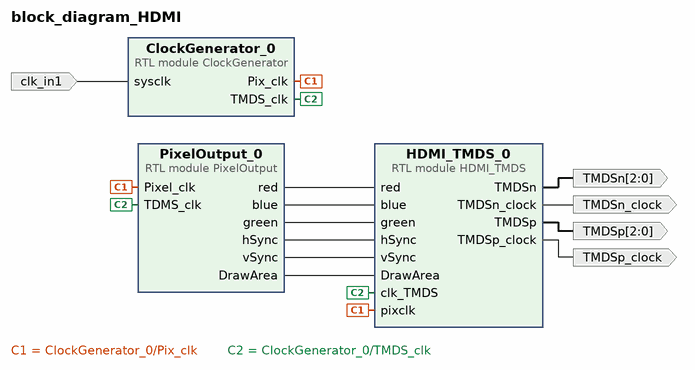
[diagram p0: block diagram of the top level]
# Vivado block design block_diagram_HDMI, xc7z020clg400-1, Vivado 2018.2
create_bd_design block_diagram_HDMI

create_bd_port -dir O -type clk TMDSn_clock
create_bd_port -dir O -type clk TMDSp_clock
create_bd_port -dir O -from 2 -to 0 TMDSp
create_bd_port -dir O -from 2 -to 0 TMDSn
create_bd_port -dir I clk_in1

create_bd_cell -type module -reference HDMI_TMDS HDMI_TMDS_0
create_bd_cell -type module -reference ClockGenerator ClockGenerator_0
create_bd_cell -type module -reference PixelOutput PixelOutput_0

# ---- connections ----

connect_bd_net [get_bd_pins PixelOutput_0/red] [get_bd_pins HDMI_TMDS_0/red]
connect_bd_net [get_bd_pins PixelOutput_0/blue] [get_bd_pins HDMI_TMDS_0/blue]
connect_bd_net [get_bd_pins PixelOutput_0/green] [get_bd_pins HDMI_TMDS_0/green]
connect_bd_net [get_bd_pins PixelOutput_0/hSync] [get_bd_pins HDMI_TMDS_0/hSync]
connect_bd_net [get_bd_pins PixelOutput_0/vSync] [get_bd_pins HDMI_TMDS_0/vSync]
connect_bd_net [get_bd_pins PixelOutput_0/DrawArea] [get_bd_pins HDMI_TMDS_0/DrawArea]
connect_bd_net [get_bd_pins HDMI_TMDS_0/TMDSn_clock] [get_bd_ports TMDSn_clock]
connect_bd_net [get_bd_pins HDMI_TMDS_0/TMDSp_clock] [get_bd_ports TMDSp_clock]
connect_bd_net [get_bd_pins HDMI_TMDS_0/TMDSp] [get_bd_ports TMDSp]
connect_bd_net [get_bd_pins HDMI_TMDS_0/TMDSn] [get_bd_ports TMDSn]
connect_bd_net [get_bd_pins ClockGenerator_0/Pix_clk] [get_bd_pins HDMI_TMDS_0/pixclk] [get_bd_pins PixelOutput_0/Pixel_clk]
connect_bd_net [get_bd_pins ClockGenerator_0/TMDS_clk] [get_bd_pins HDMI_TMDS_0/clk_TMDS] [get_bd_pins PixelOutput_0/TDMS_clk]
connect_bd_net -net clk_in1_1 [get_bd_ports clk_in1] [get_bd_pins ClockGenerator_0/sysclk]

validate_bd_design
save_bd_design
